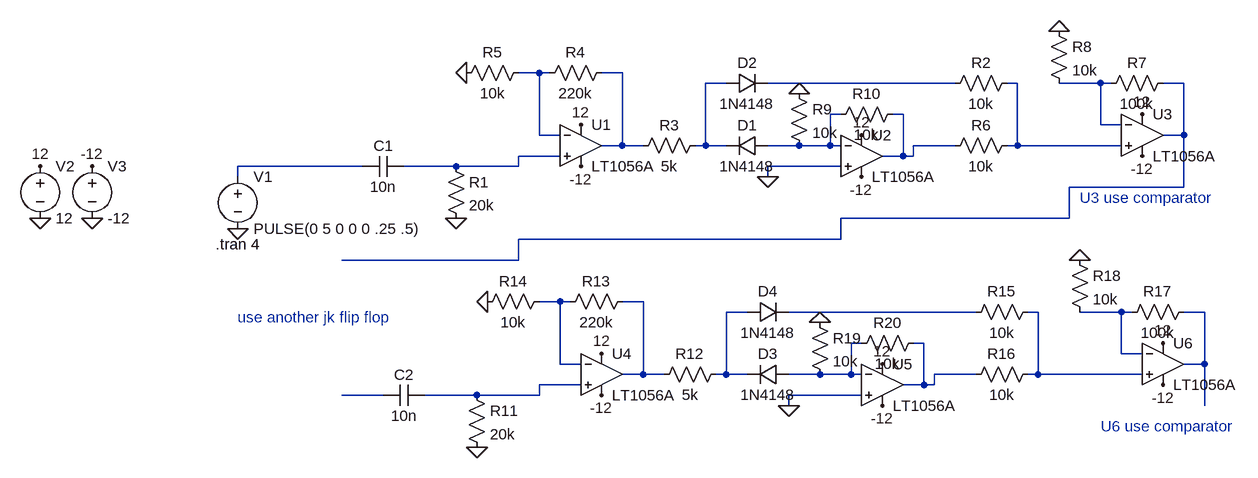
[diagram p0: schematic Draft2.asc]
Draft2.asc, the LTspice schematic file:
Version 4
SHEET 1 1176 680
WIRE -32 32 -64 32
WIRE -16 32 -32 32
WIRE 96 32 64 32
WIRE 256 48 224 48
WIRE 608 48 320 48
WIRE 704 48 688 48
WIRE 832 48 768 48
WIRE 848 48 832 48
WIRE 960 48 928 48
WIRE 432 96 416 96
WIRE 528 96 512 96
WIRE 832 112 832 48
WIRE 864 112 832 112
WIRE -32 128 -32 32
WIRE 0 128 -32 128
WIRE 960 128 960 48
WIRE 960 128 928 128
WIRE 96 144 96 32
WIRE 96 144 64 144
WIRE 128 144 96 144
WIRE 224 144 224 48
WIRE 224 144 208 144
WIRE 256 144 224 144
WIRE 368 144 320 144
WIRE 416 144 416 96
WIRE 416 144 368 144
WIRE 432 144 416 144
WIRE 608 144 544 144
WIRE 704 144 704 48
WIRE 704 144 688 144
WIRE 864 144 704 144
WIRE 0 160 -64 160
WIRE 528 160 528 96
WIRE 528 160 496 160
WIRE 544 160 544 144
WIRE 544 160 528 160
WIRE -304 176 -496 176
WIRE -160 176 -240 176
WIRE -64 176 -64 160
WIRE -64 176 -160 176
WIRE 432 176 320 176
WIRE -496 192 -496 176
WIRE 320 192 320 176
WIRE 960 208 960 128
WIRE 960 208 784 208
WIRE 784 256 784 208
WIRE 784 256 432 256
WIRE 432 288 432 256
WIRE 432 288 -64 288
WIRE -64 320 -64 288
WIRE -64 320 -336 320
WIRE 0 384 -32 384
WIRE 16 384 0 384
WIRE 128 384 96 384
WIRE 288 400 256 400
WIRE 640 400 352 400
WIRE 736 400 720 400
WIRE 864 400 800 400
WIRE 880 400 864 400
WIRE 992 400 960 400
WIRE 464 448 448 448
WIRE 560 448 544 448
WIRE 864 464 864 400
WIRE 896 464 864 464
WIRE 0 480 0 384
WIRE 32 480 0 480
WIRE 992 480 992 400
WIRE 992 480 960 480
WIRE 128 496 128 384
WIRE 128 496 96 496
WIRE 160 496 128 496
WIRE 256 496 256 400
WIRE 256 496 240 496
WIRE 288 496 256 496
WIRE 400 496 352 496
WIRE 448 496 448 448
WIRE 448 496 400 496
WIRE 464 496 448 496
WIRE 640 496 576 496
WIRE 736 496 736 400
WIRE 736 496 720 496
WIRE 896 496 736 496
WIRE 32 512 -32 512
WIRE 560 512 560 448
WIRE 560 512 528 512
WIRE 576 512 576 496
WIRE 576 512 560 512
WIRE -272 528 -336 528
WIRE -128 528 -208 528
WIRE -32 528 -32 512
WIRE -32 528 -128 528
WIRE 464 528 352 528
WIRE 352 544 352 528
WIRE 992 544 992 480
FLAG -496 272 0
FLAG -160 256 0
FLAG -720 256 0
FLAG -800 256 0
FLAG -800 176 12
FLAG 32 112 12
FLAG -720 176 -12
FLAG 32 176 -12
FLAG -144 32 0
FLAG 320 192 0
FLAG 768 -32 0
FLAG 464 128 12
FLAG 896 96 12
FLAG 464 192 -12
FLAG 896 160 -12
FLAG 368 64 0
FLAG -128 608 0
FLAG 64 464 12
FLAG 64 528 -12
FLAG -112 384 0
FLAG 352 544 0
FLAG 800 320 0
FLAG 496 480 12
FLAG 928 448 12
FLAG 496 544 -12
FLAG 928 512 -12
FLAG 400 416 0
SYMBOL voltage -496 176 R0
WINDOW 123 0 0 Left 0
WINDOW 39 0 0 Left 0
SYMATTR InstName V1
SYMATTR Value PULSE(0 5 0 0 0 .25 .5)
SYMBOL cap -240 160 R90
WINDOW 0 0 32 VBottom 2
WINDOW 3 32 32 VTop 2
SYMATTR InstName C1
SYMATTR Value 10n
SYMBOL res -176 160 R0
SYMATTR InstName R1
SYMATTR Value 20k
SYMBOL Opamps\\LT1056A 32 80 R0
SYMATTR InstName U1
SYMBOL voltage -800 160 R0
WINDOW 123 0 0 Left 0
WINDOW 39 0 0 Left 0
SYMATTR InstName V2
SYMATTR Value 12
SYMBOL voltage -720 160 R0
WINDOW 123 0 0 Left 0
WINDOW 39 0 0 Left 0
SYMATTR InstName V3
SYMATTR Value -12
SYMBOL res 224 128 R90
WINDOW 0 0 56 VBottom 2
WINDOW 3 32 56 VTop 2
SYMATTR InstName R3
SYMATTR Value 5k
SYMBOL res 80 16 R90
WINDOW 0 0 56 VBottom 2
WINDOW 3 32 56 VTop 2
SYMATTR InstName R4
SYMATTR Value 220k
SYMBOL res -48 16 R90
WINDOW 0 0 56 VBottom 2
WINDOW 3 32 56 VTop 2
SYMATTR InstName R5
SYMATTR Value 10k
SYMBOL Opamps\\LT1056A 464 96 R0
SYMATTR InstName U2
SYMBOL diode 320 128 R90
WINDOW 0 0 32 VBottom 2
WINDOW 3 32 32 VTop 2
SYMATTR InstName D1
SYMATTR Value 1N4148
SYMBOL diode 256 64 R270
WINDOW 0 32 32 VTop 2
WINDOW 3 0 32 VBottom 2
SYMATTR InstName D2
SYMATTR Value 1N4148
SYMBOL res 704 32 R90
WINDOW 0 0 56 VBottom 2
WINDOW 3 32 56 VTop 2
SYMATTR InstName R2
SYMATTR Value 10k
SYMBOL res 704 128 R90
WINDOW 0 0 56 VBottom 2
WINDOW 3 32 56 VTop 2
SYMATTR InstName R6
SYMATTR Value 10k
SYMBOL Opamps\\LT1056A 896 64 R0
SYMATTR InstName U3
SYMBOL res 944 32 R90
WINDOW 0 0 56 VBottom 2
WINDOW 3 32 56 VTop 2
SYMATTR InstName R7
SYMATTR Value 100k
SYMBOL res 752 -48 R0
SYMATTR InstName R8
SYMATTR Value 10k
SYMBOL res 352 48 R0
SYMATTR InstName R9
SYMATTR Value 10k
SYMBOL res 528 80 R90
WINDOW 0 0 56 VBottom 2
WINDOW 3 32 56 VTop 2
SYMATTR InstName R10
SYMATTR Value 10k
SYMBOL cap -208 512 R90
WINDOW 0 0 32 VBottom 2
WINDOW 3 32 32 VTop 2
SYMATTR InstName C2
SYMATTR Value 10n
SYMBOL res -144 512 R0
SYMATTR InstName R11
SYMATTR Value 20k
SYMBOL Opamps\\LT1056A 64 432 R0
SYMATTR InstName U4
SYMBOL res 256 480 R90
WINDOW 0 0 56 VBottom 2
WINDOW 3 32 56 VTop 2
SYMATTR InstName R12
SYMATTR Value 5k
SYMBOL res 112 368 R90
WINDOW 0 0 56 VBottom 2
WINDOW 3 32 56 VTop 2
SYMATTR InstName R13
SYMATTR Value 220k
SYMBOL res -16 368 R90
WINDOW 0 0 56 VBottom 2
WINDOW 3 32 56 VTop 2
SYMATTR InstName R14
SYMATTR Value 10k
SYMBOL Opamps\\LT1056A 496 448 R0
SYMATTR InstName U5
SYMBOL diode 352 480 R90
WINDOW 0 0 32 VBottom 2
WINDOW 3 32 32 VTop 2
SYMATTR InstName D3
SYMATTR Value 1N4148
SYMBOL diode 288 416 R270
WINDOW 0 32 32 VTop 2
WINDOW 3 0 32 VBottom 2
SYMATTR InstName D4
SYMATTR Value 1N4148
SYMBOL res 736 384 R90
WINDOW 0 0 56 VBottom 2
WINDOW 3 32 56 VTop 2
SYMATTR InstName R15
SYMATTR Value 10k
SYMBOL res 736 480 R90
WINDOW 0 0 56 VBottom 2
WINDOW 3 32 56 VTop 2
SYMATTR InstName R16
SYMATTR Value 10k
SYMBOL Opamps\\LT1056A 928 416 R0
SYMATTR InstName U6
SYMBOL res 976 384 R90
WINDOW 0 0 56 VBottom 2
WINDOW 3 32 56 VTop 2
SYMATTR InstName R17
SYMATTR Value 100k
SYMBOL res 784 304 R0
SYMATTR InstName R18
SYMATTR Value 10k
SYMBOL res 384 400 R0
SYMATTR InstName R19
SYMATTR Value 10k
SYMBOL res 560 432 R90
WINDOW 0 0 56 VBottom 2
WINDOW 3 32 56 VTop 2
SYMATTR InstName R20
SYMATTR Value 10k
TEXT -530 296 Left 2 !.tran 4
TEXT 800 224 Left 2 ;U3 use comparator
TEXT 832 576 Left 2 ;U6 use comparator
TEXT -496 408 Left 2 ;use another jk flip flop

The netlist it stands for:
* Draft2.asc
V1 N011 0 PULSE(0 5 0 0 0 .25 .5)
C1 N010 N011 10n
R1 N010 0 20k
XU1 N010 N001 12 -12 N002 LT1056A  ; pins In+ In- V+ V- OUT
V2 12 0 12
V3 -12 0 -12
R3 N003 N002 5k
R4 N002 N001 220k
R5 N001 0 10k
XU2 0 N008 12 -12 N009 LT1056A  ; pins In+ In- V+ V- OUT
D1 N008 N003 1N4148
D2 N003 N004 1N4148
R2 N005 N004 10k
R6 N005 N009 10k
XU3 N005 N006 12 -12 N007 LT1056A  ; pins In+ In- V+ V- OUT
R7 N007 N006 100k
R8 0 N006 10k
R9 0 N008 10k
R10 N009 N008 10k
C2 N021 N022 10n
R11 N021 0 20k
XU4 N021 N012 12 -12 N013 LT1056A  ; pins In+ In- V+ V- OUT
R12 N014 N013 5k
R13 N013 N012 220k
R14 N012 0 10k
XU5 0 N019 12 -12 N020 LT1056A  ; pins In+ In- V+ V- OUT
D3 N019 N014 1N4148
D4 N014 N015 1N4148
R15 N016 N015 10k
R16 N016 N020 10k
XU6 N016 N017 12 -12 N018 LT1056A  ; pins In+ In- V+ V- OUT
R17 N018 N017 100k
R18 0 N017 10k
R19 0 N019 10k
R20 N020 N019 10k
.model D D
.lib standard.dio
.tran 4
* U3 use comparator
* U6 use comparator
* use another jk flip flop
.backanno
.end